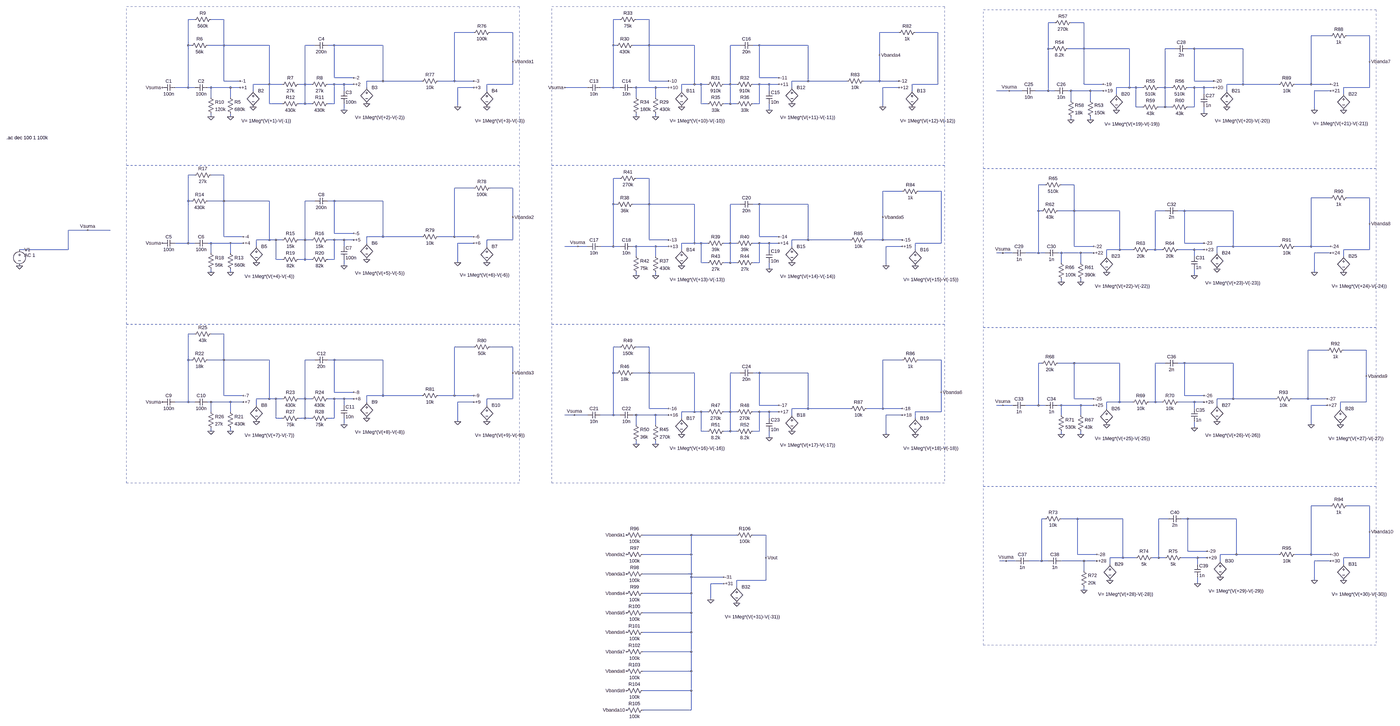
[diagram p0: schematic Ecualizador.asc, whole sheet]
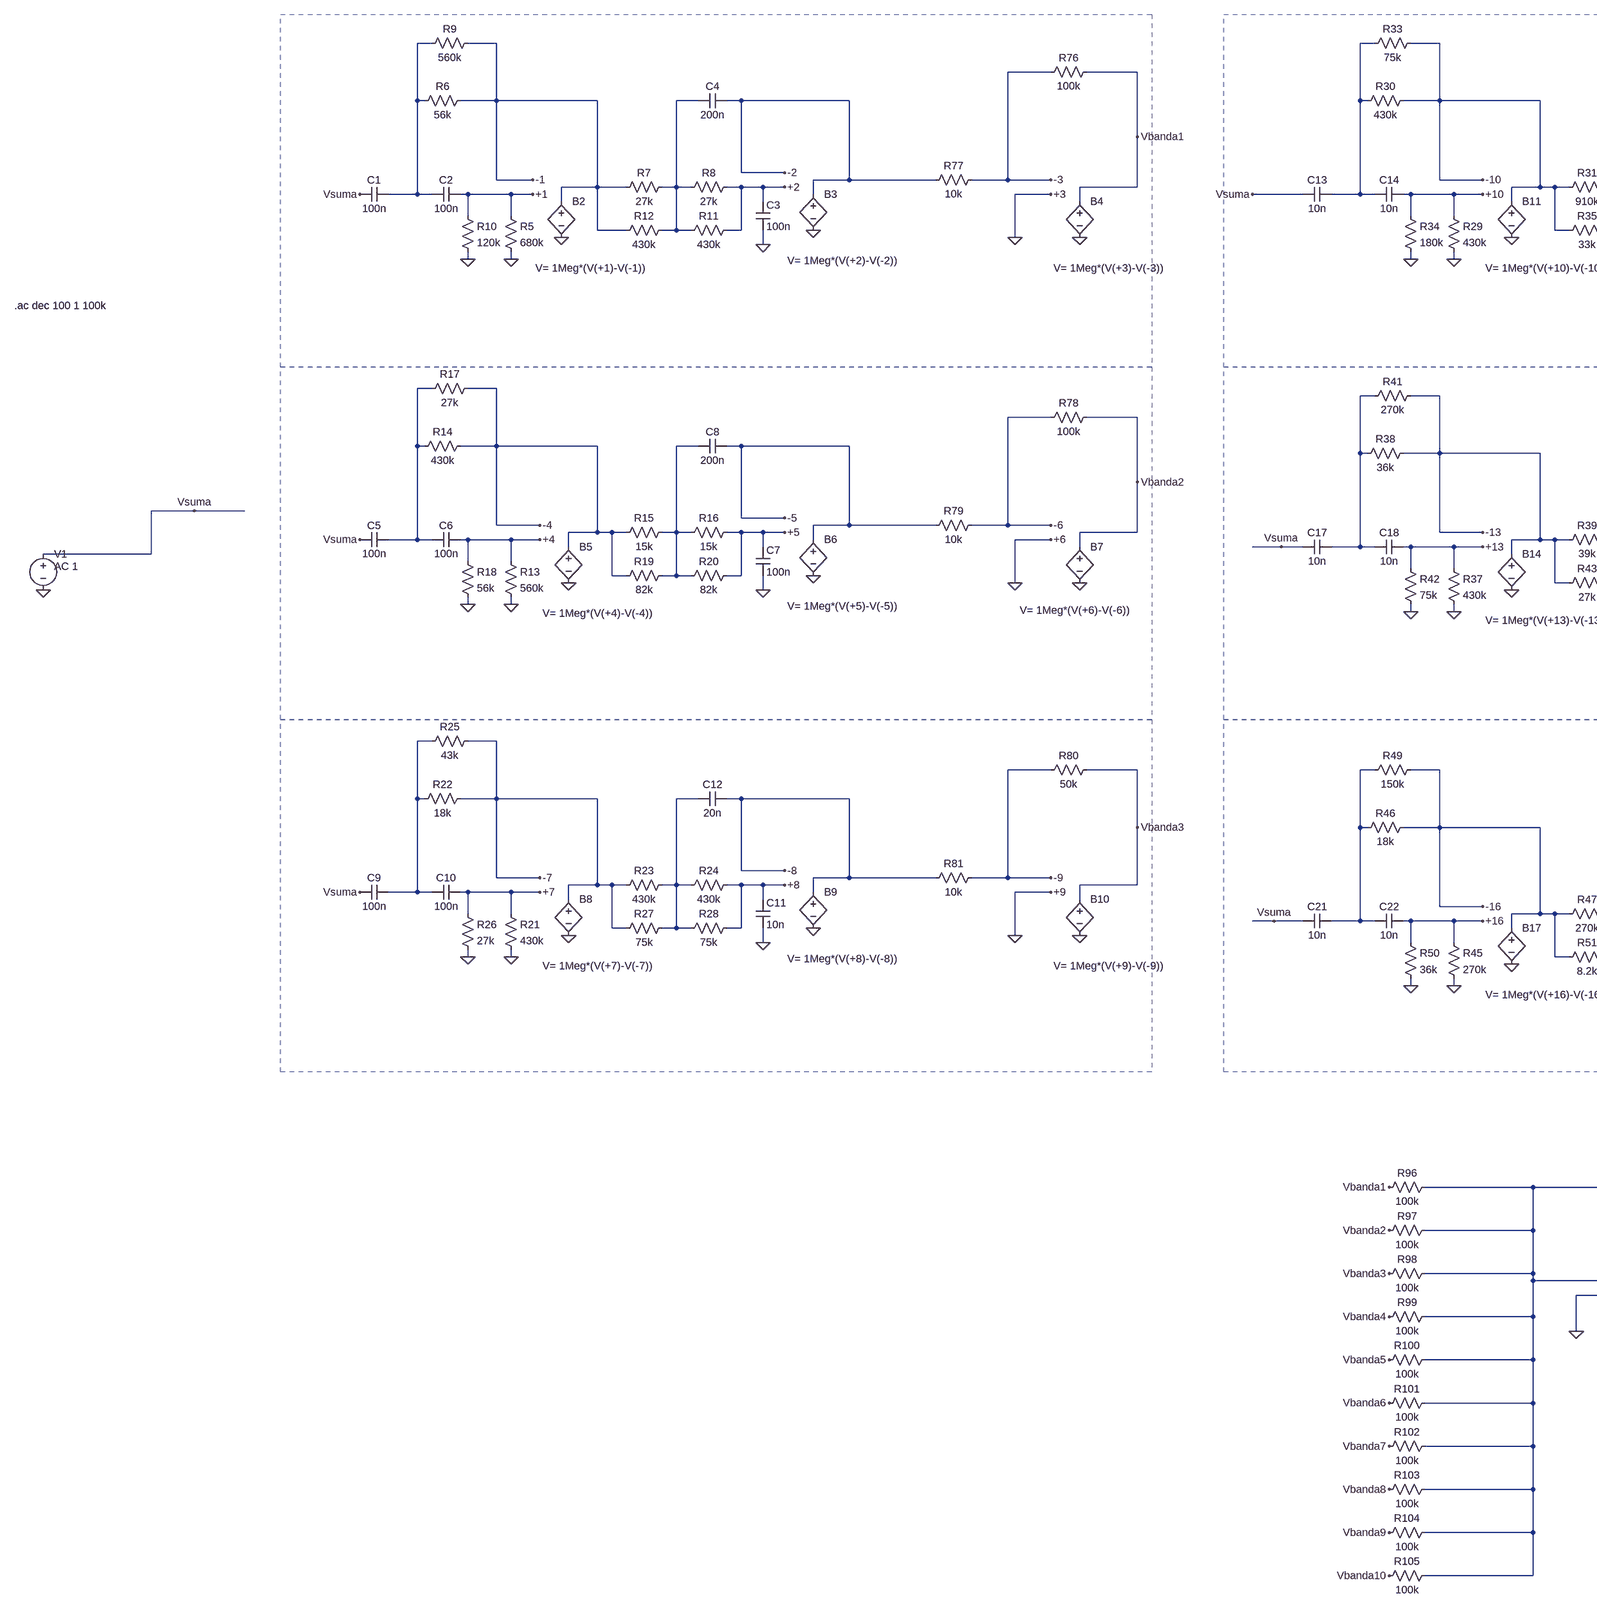
[diagram p1: schematic Ecualizador.asc, part, row 1 of 1, column 1 of 2]
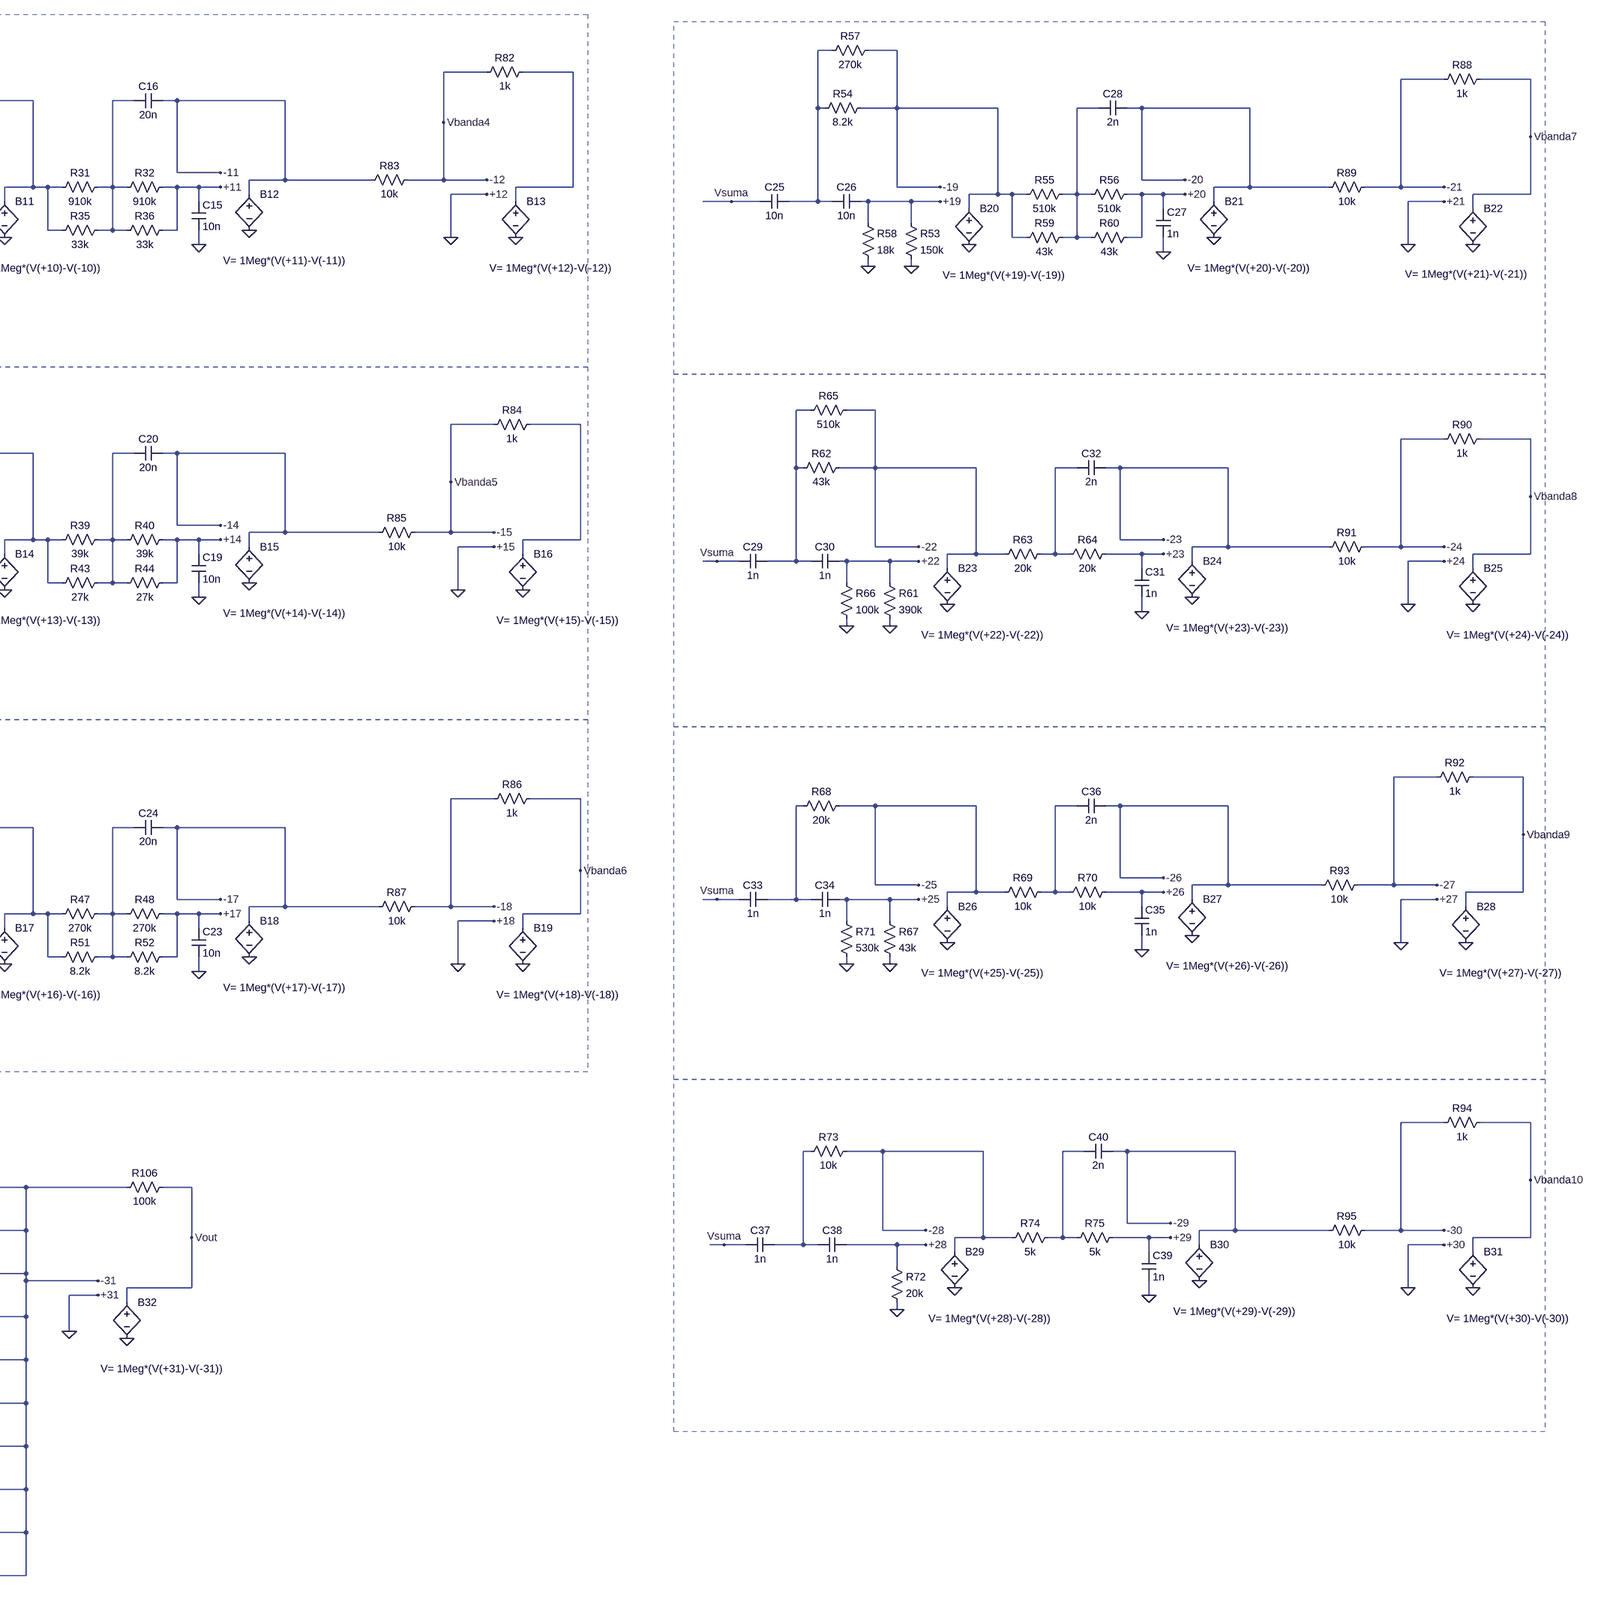
[diagram p2: schematic Ecualizador.asc, part, row 1 of 1, column 2 of 2]
Ecualizador.asc, the LTspice schematic file:
Version 4
SHEET 1 880 680
WIRE -20480 -74048 -20512 -74048
WIRE -20336 -74048 -20400 -74048
WIRE -18384 -74048 -18416 -74048
WIRE -18240 -74048 -18304 -74048
WIRE -16112 -74032 -16144 -74032
WIRE -15968 -74032 -16032 -74032
WIRE -19104 -73984 -19200 -73984
WIRE -18912 -73984 -19024 -73984
WIRE -17008 -73984 -17104 -73984
WIRE -16816 -73984 -16928 -73984
WIRE -14752 -73968 -14848 -73968
WIRE -14560 -73968 -14672 -73968
WIRE -20512 -73920 -20512 -74048
WIRE -20496 -73920 -20512 -73920
WIRE -20336 -73920 -20336 -74048
WIRE -20336 -73920 -20416 -73920
WIRE -20112 -73920 -20336 -73920
WIRE -19888 -73920 -19936 -73920
WIRE -19792 -73920 -19824 -73920
WIRE -19552 -73920 -19792 -73920
WIRE -18416 -73920 -18416 -74048
WIRE -18400 -73920 -18416 -73920
WIRE -18240 -73920 -18240 -74048
WIRE -18240 -73920 -18320 -73920
WIRE -18016 -73920 -18240 -73920
WIRE -17792 -73920 -17840 -73920
WIRE -17696 -73920 -17728 -73920
WIRE -17456 -73920 -17696 -73920
WIRE -16144 -73904 -16144 -74032
WIRE -16128 -73904 -16144 -73904
WIRE -15968 -73904 -15968 -74032
WIRE -15968 -73904 -16048 -73904
WIRE -15744 -73904 -15968 -73904
WIRE -15520 -73904 -15568 -73904
WIRE -15424 -73904 -15456 -73904
WIRE -15184 -73904 -15424 -73904
WIRE -17104 -73872 -17104 -73984
WIRE -18912 -73840 -18912 -73984
WIRE -14560 -73840 -14560 -73968
WIRE -19792 -73760 -19792 -73920
WIRE -19696 -73760 -19792 -73760
WIRE -17696 -73760 -17696 -73920
WIRE -17600 -73760 -17696 -73760
WIRE -20336 -73744 -20336 -73920
WIRE -20256 -73744 -20336 -73744
WIRE -19552 -73744 -19552 -73920
WIRE -19552 -73744 -19632 -73744
WIRE -19360 -73744 -19552 -73744
WIRE -19200 -73744 -19200 -73984
WIRE -19200 -73744 -19280 -73744
WIRE -19104 -73744 -19200 -73744
WIRE -18240 -73744 -18240 -73920
WIRE -18144 -73744 -18240 -73744
WIRE -17456 -73744 -17456 -73920
WIRE -17456 -73744 -17536 -73744
WIRE -17264 -73744 -17456 -73744
WIRE -17104 -73744 -17104 -73872
WIRE -17104 -73744 -17184 -73744
WIRE -17008 -73744 -17104 -73744
WIRE -15424 -73744 -15424 -73904
WIRE -15328 -73744 -15424 -73744
WIRE -20112 -73728 -20112 -73920
WIRE -20112 -73728 -20192 -73728
WIRE -20048 -73728 -20112 -73728
WIRE -19936 -73728 -19936 -73920
WIRE -19936 -73728 -19968 -73728
WIRE -19904 -73728 -19936 -73728
WIRE -19792 -73728 -19824 -73728
WIRE -19744 -73728 -19792 -73728
WIRE -19696 -73728 -19744 -73728
WIRE -18912 -73728 -18912 -73840
WIRE -18912 -73728 -19040 -73728
WIRE -18016 -73728 -18016 -73920
WIRE -18016 -73728 -18080 -73728
WIRE -17984 -73728 -18016 -73728
WIRE -17952 -73728 -17984 -73728
WIRE -17840 -73728 -17840 -73920
WIRE -17840 -73728 -17872 -73728
WIRE -17808 -73728 -17840 -73728
WIRE -17696 -73728 -17728 -73728
WIRE -17648 -73728 -17696 -73728
WIRE -17600 -73728 -17648 -73728
WIRE -16816 -73728 -16816 -73984
WIRE -16816 -73728 -16944 -73728
WIRE -15968 -73728 -15968 -73904
WIRE -15872 -73728 -15968 -73728
WIRE -15184 -73728 -15184 -73904
WIRE -15184 -73728 -15264 -73728
WIRE -15008 -73728 -15184 -73728
WIRE -14848 -73728 -14848 -73968
WIRE -14848 -73728 -14928 -73728
WIRE -14752 -73728 -14848 -73728
WIRE -20512 -73712 -20512 -73920
WIRE -20512 -73712 -20576 -73712
WIRE -20480 -73712 -20512 -73712
WIRE -20400 -73712 -20416 -73712
WIRE -20304 -73712 -20400 -73712
WIRE -20256 -73712 -20304 -73712
WIRE -19632 -73712 -19632 -73744
WIRE -19104 -73712 -19184 -73712
WIRE -18544 -73712 -18656 -73712
WIRE -18416 -73712 -18416 -73920
WIRE -18416 -73712 -18480 -73712
WIRE -18384 -73712 -18416 -73712
WIRE -18304 -73712 -18320 -73712
WIRE -18208 -73712 -18304 -73712
WIRE -18144 -73712 -18208 -73712
WIRE -17536 -73712 -17536 -73744
WIRE -17008 -73712 -17088 -73712
WIRE -15744 -73712 -15744 -73904
WIRE -15744 -73712 -15808 -73712
WIRE -15712 -73712 -15744 -73712
WIRE -15680 -73712 -15712 -73712
WIRE -15568 -73712 -15568 -73904
WIRE -15568 -73712 -15600 -73712
WIRE -15536 -73712 -15568 -73712
WIRE -15424 -73712 -15456 -73712
WIRE -15376 -73712 -15424 -73712
WIRE -15328 -73712 -15376 -73712
WIRE -14560 -73712 -14560 -73840
WIRE -14560 -73712 -14688 -73712
WIRE -20192 -73696 -20192 -73728
WIRE -19744 -73696 -19744 -73728
WIRE -19040 -73696 -19040 -73728
WIRE -18080 -73696 -18080 -73728
WIRE -17648 -73696 -17648 -73728
WIRE -16944 -73696 -16944 -73728
WIRE -16336 -73696 -16400 -73696
WIRE -16272 -73696 -16336 -73696
WIRE -16144 -73696 -16144 -73904
WIRE -16144 -73696 -16208 -73696
WIRE -16112 -73696 -16144 -73696
WIRE -16032 -73696 -16048 -73696
WIRE -15936 -73696 -16032 -73696
WIRE -15872 -73696 -15936 -73696
WIRE -15264 -73696 -15264 -73728
WIRE -14752 -73696 -14832 -73696
WIRE -15808 -73680 -15808 -73712
WIRE -15376 -73680 -15376 -73712
WIRE -14688 -73680 -14688 -73712
WIRE -20400 -73664 -20400 -73712
WIRE -20304 -73664 -20304 -73712
WIRE -18304 -73664 -18304 -73712
WIRE -18208 -73664 -18208 -73712
WIRE -16032 -73648 -16032 -73696
WIRE -15936 -73648 -15936 -73696
WIRE -20112 -73632 -20112 -73728
WIRE -20048 -73632 -20112 -73632
WIRE -19936 -73632 -19936 -73728
WIRE -19936 -73632 -19968 -73632
WIRE -19904 -73632 -19936 -73632
WIRE -19792 -73632 -19792 -73728
WIRE -19792 -73632 -19824 -73632
WIRE -17984 -73632 -17984 -73728
WIRE -17952 -73632 -17984 -73632
WIRE -17840 -73632 -17840 -73728
WIRE -17840 -73632 -17872 -73632
WIRE -17808 -73632 -17840 -73632
WIRE -17696 -73632 -17696 -73728
WIRE -17696 -73632 -17728 -73632
WIRE -19184 -73616 -19184 -73712
WIRE -17088 -73616 -17088 -73712
WIRE -15712 -73616 -15712 -73712
WIRE -15680 -73616 -15712 -73616
WIRE -15568 -73616 -15568 -73712
WIRE -15568 -73616 -15600 -73616
WIRE -15536 -73616 -15568 -73616
WIRE -15424 -73616 -15424 -73712
WIRE -15424 -73616 -15456 -73616
WIRE -19744 -73600 -19744 -73632
WIRE -17648 -73600 -17648 -73632
WIRE -14832 -73600 -14832 -73696
WIRE -15376 -73584 -15376 -73616
WIRE -20400 -73568 -20400 -73584
WIRE -20304 -73568 -20304 -73584
WIRE -18304 -73568 -18304 -73584
WIRE -18208 -73568 -18208 -73584
WIRE -16032 -73552 -16032 -73568
WIRE -15936 -73552 -15936 -73568
WIRE -20480 -73280 -20512 -73280
WIRE -20336 -73280 -20400 -73280
WIRE -18384 -73264 -18416 -73264
WIRE -18240 -73264 -18304 -73264
WIRE -16160 -73232 -16192 -73232
WIRE -16016 -73232 -16080 -73232
WIRE -19104 -73216 -19200 -73216
WIRE -18912 -73216 -19024 -73216
WIRE -16992 -73200 -17088 -73200
WIRE -16800 -73200 -16912 -73200
WIRE -14752 -73168 -14848 -73168
WIRE -14560 -73168 -14672 -73168
WIRE -20512 -73152 -20512 -73280
WIRE -20496 -73152 -20512 -73152
WIRE -20336 -73152 -20336 -73280
WIRE -20336 -73152 -20416 -73152
WIRE -20112 -73152 -20336 -73152
WIRE -19888 -73152 -19936 -73152
WIRE -19792 -73152 -19824 -73152
WIRE -19552 -73152 -19792 -73152
WIRE -18416 -73136 -18416 -73264
WIRE -18400 -73136 -18416 -73136
WIRE -18240 -73136 -18240 -73264
WIRE -18240 -73136 -18320 -73136
WIRE -18016 -73136 -18240 -73136
WIRE -17792 -73136 -17840 -73136
WIRE -17696 -73136 -17728 -73136
WIRE -17456 -73136 -17696 -73136
WIRE -16192 -73104 -16192 -73232
WIRE -16176 -73104 -16192 -73104
WIRE -16016 -73104 -16016 -73232
WIRE -16016 -73104 -16096 -73104
WIRE -15792 -73104 -16016 -73104
WIRE -15568 -73104 -15616 -73104
WIRE -15472 -73104 -15504 -73104
WIRE -15232 -73104 -15472 -73104
WIRE -18912 -73072 -18912 -73216
WIRE -17088 -73072 -17088 -73200
WIRE -14560 -73040 -14560 -73168
WIRE -21008 -73008 -21104 -73008
WIRE -20896 -73008 -21008 -73008
WIRE -19792 -72992 -19792 -73152
WIRE -19696 -72992 -19792 -72992
WIRE -20336 -72976 -20336 -73152
WIRE -20240 -72976 -20336 -72976
WIRE -19552 -72976 -19552 -73152
WIRE -19552 -72976 -19632 -72976
WIRE -19360 -72976 -19552 -72976
WIRE -19200 -72976 -19200 -73216
WIRE -19200 -72976 -19280 -72976
WIRE -19104 -72976 -19200 -72976
WIRE -17696 -72976 -17696 -73136
WIRE -17600 -72976 -17696 -72976
WIRE -20112 -72960 -20112 -73152
WIRE -20112 -72960 -20176 -72960
WIRE -20080 -72960 -20112 -72960
WIRE -20048 -72960 -20080 -72960
WIRE -19936 -72960 -19936 -73152
WIRE -19936 -72960 -19968 -72960
WIRE -19904 -72960 -19936 -72960
WIRE -19792 -72960 -19824 -72960
WIRE -19744 -72960 -19792 -72960
WIRE -19696 -72960 -19744 -72960
WIRE -18912 -72960 -18912 -73072
WIRE -18912 -72960 -19040 -72960
WIRE -18240 -72960 -18240 -73136
WIRE -18144 -72960 -18240 -72960
WIRE -17456 -72960 -17456 -73136
WIRE -17456 -72960 -17536 -72960
WIRE -17248 -72960 -17456 -72960
WIRE -17088 -72960 -17088 -73072
WIRE -17088 -72960 -17168 -72960
WIRE -16992 -72960 -17088 -72960
WIRE -20512 -72944 -20512 -73152
WIRE -20512 -72944 -20576 -72944
WIRE -20480 -72944 -20512 -72944
WIRE -20400 -72944 -20416 -72944
WIRE -20304 -72944 -20400 -72944
WIRE -20240 -72944 -20304 -72944
WIRE -19632 -72944 -19632 -72976
WIRE -19104 -72944 -19184 -72944
WIRE -18016 -72944 -18016 -73136
WIRE -18016 -72944 -18080 -72944
WIRE -17984 -72944 -18016 -72944
WIRE -17952 -72944 -17984 -72944
WIRE -17840 -72944 -17840 -73136
WIRE -17840 -72944 -17872 -72944
WIRE -17808 -72944 -17840 -72944
WIRE -17696 -72944 -17728 -72944
WIRE -17648 -72944 -17696 -72944
WIRE -17600 -72944 -17648 -72944
WIRE -16800 -72944 -16800 -73200
WIRE -16800 -72944 -16928 -72944
WIRE -15472 -72944 -15472 -73104
WIRE -15376 -72944 -15472 -72944
WIRE -20176 -72928 -20176 -72960
WIRE -19744 -72928 -19744 -72960
WIRE -19040 -72928 -19040 -72960
WIRE -18592 -72928 -18656 -72928
WIRE -18544 -72928 -18592 -72928
WIRE -18416 -72928 -18416 -73136
WIRE -18416 -72928 -18480 -72928
WIRE -18384 -72928 -18416 -72928
WIRE -18304 -72928 -18320 -72928
WIRE -18208 -72928 -18304 -72928
WIRE -18144 -72928 -18208 -72928
WIRE -17536 -72928 -17536 -72960
WIRE -16992 -72928 -17072 -72928
WIRE -16016 -72928 -16016 -73104
WIRE -15920 -72928 -16016 -72928
WIRE -15232 -72928 -15232 -73104
WIRE -15232 -72928 -15312 -72928
WIRE -15008 -72928 -15232 -72928
WIRE -14848 -72928 -14848 -73168
WIRE -14848 -72928 -14928 -72928
WIRE -14752 -72928 -14848 -72928
WIRE -21104 -72912 -21104 -73008
WIRE -21104 -72912 -21344 -72912
WIRE -18080 -72912 -18080 -72944
WIRE -17648 -72912 -17648 -72944
WIRE -16928 -72912 -16928 -72944
WIRE -15792 -72912 -15792 -73104
WIRE -15792 -72912 -15856 -72912
WIRE -15728 -72912 -15792 -72912
WIRE -15616 -72912 -15616 -73104
WIRE -15616 -72912 -15648 -72912
WIRE -15584 -72912 -15616 -72912
WIRE -15424 -72912 -15504 -72912
WIRE -15376 -72912 -15424 -72912
WIRE -14560 -72912 -14560 -73040
WIRE -14560 -72912 -14688 -72912
WIRE -20400 -72896 -20400 -72944
WIRE -20304 -72896 -20304 -72944
WIRE -16368 -72896 -16400 -72896
WIRE -16320 -72896 -16368 -72896
WIRE -16192 -72896 -16192 -73104
WIRE -16192 -72896 -16256 -72896
WIRE -16160 -72896 -16192 -72896
WIRE -16080 -72896 -16096 -72896
WIRE -15984 -72896 -16080 -72896
WIRE -15920 -72896 -15984 -72896
WIRE -15312 -72896 -15312 -72928
WIRE -14752 -72896 -14832 -72896
WIRE -18304 -72880 -18304 -72928
WIRE -18208 -72880 -18208 -72928
WIRE -15856 -72880 -15856 -72912
WIRE -15424 -72880 -15424 -72912
WIRE -14688 -72880 -14688 -72912
WIRE -20080 -72864 -20080 -72960
WIRE -20048 -72864 -20080 -72864
WIRE -19936 -72864 -19936 -72960
WIRE -19936 -72864 -19968 -72864
WIRE -19904 -72864 -19936 -72864
WIRE -19792 -72864 -19792 -72960
WIRE -19792 -72864 -19824 -72864
WIRE -19184 -72848 -19184 -72944
WIRE -17984 -72848 -17984 -72944
WIRE -17952 -72848 -17984 -72848
WIRE -17840 -72848 -17840 -72944
WIRE -17840 -72848 -17872 -72848
WIRE -17808 -72848 -17840 -72848
WIRE -17696 -72848 -17696 -72944
WIRE -17696 -72848 -17728 -72848
WIRE -16080 -72848 -16080 -72896
WIRE -15984 -72848 -15984 -72896
WIRE -19744 -72832 -19744 -72864
WIRE -17072 -72832 -17072 -72928
WIRE -17648 -72816 -17648 -72848
WIRE -20400 -72800 -20400 -72816
WIRE -20304 -72800 -20304 -72816
WIRE -14832 -72800 -14832 -72896
WIRE -18304 -72784 -18304 -72800
WIRE -18208 -72784 -18208 -72800
WIRE -15424 -72784 -15424 -72816
WIRE -16080 -72752 -16080 -72768
WIRE -15984 -72752 -15984 -72768
WIRE -20480 -72496 -20512 -72496
WIRE -20336 -72496 -20400 -72496
WIRE -19104 -72432 -19200 -72432
WIRE -18912 -72432 -19024 -72432
WIRE -18384 -72432 -18416 -72432
WIRE -18240 -72432 -18304 -72432
WIRE -14768 -72416 -14864 -72416
WIRE -14576 -72416 -14688 -72416
WIRE -20512 -72368 -20512 -72496
WIRE -20496 -72368 -20512 -72368
WIRE -20336 -72368 -20336 -72496
WIRE -20336 -72368 -20416 -72368
WIRE -20112 -72368 -20336 -72368
WIRE -19888 -72368 -19936 -72368
WIRE -19792 -72368 -19824 -72368
WIRE -19552 -72368 -19792 -72368
WIRE -16992 -72368 -17088 -72368
WIRE -16800 -72368 -16912 -72368
WIRE -16176 -72352 -16192 -72352
WIRE -16016 -72352 -16096 -72352
WIRE -15792 -72352 -16016 -72352
WIRE -15568 -72352 -15616 -72352
WIRE -15472 -72352 -15504 -72352
WIRE -15232 -72352 -15472 -72352
WIRE -18912 -72304 -18912 -72432
WIRE -18416 -72304 -18416 -72432
WIRE -18400 -72304 -18416 -72304
WIRE -18240 -72304 -18240 -72432
WIRE -18240 -72304 -18320 -72304
WIRE -18016 -72304 -18240 -72304
WIRE -17792 -72304 -17840 -72304
WIRE -17696 -72304 -17728 -72304
WIRE -17456 -72304 -17696 -72304
WIRE -14576 -72288 -14576 -72416
WIRE -19792 -72208 -19792 -72368
WIRE -19696 -72208 -19792 -72208
WIRE -16800 -72208 -16800 -72368
WIRE -20336 -72192 -20336 -72368
WIRE -20240 -72192 -20336 -72192
WIRE -19552 -72192 -19552 -72368
WIRE -19552 -72192 -19632 -72192
WIRE -19360 -72192 -19552 -72192
WIRE -19200 -72192 -19200 -72432
WIRE -19200 -72192 -19280 -72192
WIRE -19104 -72192 -19200 -72192
WIRE -15472 -72192 -15472 -72352
WIRE -15376 -72192 -15472 -72192
WIRE -20112 -72176 -20112 -72368
WIRE -20112 -72176 -20176 -72176
WIRE -20080 -72176 -20112 -72176
WIRE -20048 -72176 -20080 -72176
WIRE -19936 -72176 -19936 -72368
WIRE -19936 -72176 -19968 -72176
WIRE -19904 -72176 -19936 -72176
WIRE -19792 -72176 -19824 -72176
WIRE -19744 -72176 -19792 -72176
WIRE -19696 -72176 -19744 -72176
WIRE -18912 -72176 -18912 -72304
WIRE -18912 -72176 -19040 -72176
WIRE -16016 -72176 -16016 -72352
WIRE -15920 -72176 -16016 -72176
WIRE -15232 -72176 -15232 -72352
WIRE -15232 -72176 -15312 -72176
WIRE -15024 -72176 -15232 -72176
WIRE -14864 -72176 -14864 -72416
WIRE -14864 -72176 -14944 -72176
WIRE -14768 -72176 -14864 -72176
WIRE -20512 -72160 -20512 -72368
WIRE -20512 -72160 -20576 -72160
WIRE -20480 -72160 -20512 -72160
WIRE -20400 -72160 -20416 -72160
WIRE -20304 -72160 -20400 -72160
WIRE -20240 -72160 -20304 -72160
WIRE -19632 -72160 -19632 -72192
WIRE -19104 -72160 -19184 -72160
WIRE -15792 -72160 -15792 -72352
WIRE -15792 -72160 -15856 -72160
WIRE -15728 -72160 -15792 -72160
WIRE -15616 -72160 -15616 -72352
WIRE -15616 -72160 -15648 -72160
WIRE -15584 -72160 -15616 -72160
WIRE -15424 -72160 -15504 -72160
WIRE -15376 -72160 -15424 -72160
WIRE -14576 -72160 -14576 -72288
WIRE -14576 -72160 -14704 -72160
WIRE -20176 -72144 -20176 -72176
WIRE -19744 -72144 -19744 -72176
WIRE -19040 -72144 -19040 -72176
WIRE -17696 -72144 -17696 -72304
WIRE -17600 -72144 -17696 -72144
WIRE -16368 -72144 -16400 -72144
WIRE -16320 -72144 -16368 -72144
WIRE -16192 -72144 -16192 -72352
WIRE -16192 -72144 -16256 -72144
WIRE -16160 -72144 -16192 -72144
WIRE -16080 -72144 -16096 -72144
WIRE -15984 -72144 -16080 -72144
WIRE -15920 -72144 -15984 -72144
WIRE -15312 -72144 -15312 -72176
WIRE -14768 -72144 -14848 -72144
WIRE -18240 -72128 -18240 -72304
WIRE -18144 -72128 -18240 -72128
WIRE -17456 -72128 -17456 -72304
WIRE -17456 -72128 -17536 -72128
WIRE -17248 -72128 -17456 -72128
WIRE -17088 -72128 -17088 -72368
WIRE -17088 -72128 -17168 -72128
WIRE -16992 -72128 -17088 -72128
WIRE -15856 -72128 -15856 -72160
WIRE -15424 -72128 -15424 -72160
WIRE -14704 -72128 -14704 -72160
WIRE -20400 -72112 -20400 -72160
WIRE -20304 -72112 -20304 -72160
WIRE -18016 -72112 -18016 -72304
WIRE -18016 -72112 -18080 -72112
WIRE -17984 -72112 -18016 -72112
WIRE -17952 -72112 -17984 -72112
WIRE -17840 -72112 -17840 -72304
WIRE -17840 -72112 -17872 -72112
WIRE -17808 -72112 -17840 -72112
WIRE -17696 -72112 -17728 -72112
WIRE -17648 -72112 -17696 -72112
WIRE -17600 -72112 -17648 -72112
WIRE -16800 -72112 -16800 -72208
WIRE -16800 -72112 -16928 -72112
WIRE -18608 -72096 -18656 -72096
WIRE -18544 -72096 -18608 -72096
WIRE -18416 -72096 -18416 -72304
WIRE -18416 -72096 -18480 -72096
WIRE -18384 -72096 -18416 -72096
WIRE -18304 -72096 -18320 -72096
WIRE -18208 -72096 -18304 -72096
WIRE -18144 -72096 -18208 -72096
WIRE -17536 -72096 -17536 -72128
WIRE -16992 -72096 -17072 -72096
WIRE -16080 -72096 -16080 -72144
WIRE -15984 -72096 -15984 -72144
WIRE -20080 -72080 -20080 -72176
WIRE -20048 -72080 -20080 -72080
WIRE -19936 -72080 -19936 -72176
WIRE -19936 -72080 -19968 -72080
WIRE -19904 -72080 -19936 -72080
WIRE -19792 -72080 -19792 -72176
WIRE -19792 -72080 -19824 -72080
WIRE -18080 -72080 -18080 -72112
WIRE -17648 -72080 -17648 -72112
WIRE -16928 -72080 -16928 -72112
WIRE -19184 -72064 -19184 -72160
WIRE -19744 -72048 -19744 -72080
WIRE -18304 -72048 -18304 -72096
WIRE -18208 -72048 -18208 -72096
WIRE -14848 -72048 -14848 -72144
WIRE -15424 -72032 -15424 -72064
WIRE -20400 -72016 -20400 -72032
WIRE -20304 -72016 -20304 -72032
WIRE -17984 -72016 -17984 -72112
WIRE -17952 -72016 -17984 -72016
WIRE -17840 -72016 -17840 -72112
WIRE -17840 -72016 -17872 -72016
WIRE -17808 -72016 -17840 -72016
WIRE -17696 -72016 -17696 -72112
WIRE -17696 -72016 -17728 -72016
WIRE -17072 -72000 -17072 -72096
WIRE -16080 -72000 -16080 -72016
WIRE -15984 -72000 -15984 -72016
WIRE -17648 -71984 -17648 -72016
WIRE -18304 -71952 -18304 -71968
WIRE -18208 -71952 -18208 -71968
WIRE -14752 -71648 -14848 -71648
WIRE -14560 -71648 -14672 -71648
WIRE -16160 -71584 -16176 -71584
WIRE -16000 -71584 -16080 -71584
WIRE -15776 -71584 -16000 -71584
WIRE -15552 -71584 -15600 -71584
WIRE -15456 -71584 -15488 -71584
WIRE -15216 -71584 -15456 -71584
WIRE -14560 -71520 -14560 -71648
WIRE -18032 -71504 -18272 -71504
WIRE -17808 -71504 -18032 -71504
WIRE -17664 -71504 -17728 -71504
WIRE -15456 -71424 -15456 -71584
WIRE -15360 -71424 -15456 -71424
WIRE -18032 -71408 -18032 -71504
WIRE -18032 -71408 -18272 -71408
WIRE -16000 -71408 -16000 -71584
WIRE -15904 -71408 -16000 -71408
WIRE -15216 -71408 -15216 -71584
WIRE -15216 -71408 -15296 -71408
WIRE -15008 -71408 -15216 -71408
WIRE -14848 -71408 -14848 -71648
WIRE -14848 -71408 -14928 -71408
WIRE -14752 -71408 -14848 -71408
WIRE -17664 -71392 -17664 -71504
WIRE -15776 -71392 -15776 -71584
WIRE -15776 -71392 -15840 -71392
WIRE -15712 -71392 -15776 -71392
WIRE -15600 -71392 -15600 -71584
WIRE -15600 -71392 -15632 -71392
WIRE -15568 -71392 -15600 -71392
WIRE -15408 -71392 -15488 -71392
WIRE -15360 -71392 -15408 -71392
WIRE -14560 -71392 -14560 -71520
WIRE -14560 -71392 -14688 -71392
WIRE -16352 -71376 -16384 -71376
WIRE -16304 -71376 -16352 -71376
WIRE -16176 -71376 -16176 -71584
WIRE -16176 -71376 -16240 -71376
WIRE -16144 -71376 -16176 -71376
WIRE -15968 -71376 -16080 -71376
WIRE -15904 -71376 -15968 -71376
WIRE -15296 -71376 -15296 -71408
WIRE -14752 -71376 -14832 -71376
WIRE -15840 -71360 -15840 -71392
WIRE -15408 -71360 -15408 -71392
WIRE -14688 -71360 -14688 -71392
WIRE -15968 -71328 -15968 -71376
WIRE -18032 -71312 -18032 -71408
WIRE -18032 -71312 -18272 -71312
WIRE -18032 -71296 -18032 -71312
WIRE -17872 -71296 -18032 -71296
WIRE -17664 -71280 -17664 -71392
WIRE -17664 -71280 -17808 -71280
WIRE -14832 -71280 -14832 -71376
WIRE -17872 -71264 -17936 -71264
WIRE -15408 -71264 -15408 -71296
WIRE -17808 -71248 -17808 -71280
WIRE -15968 -71232 -15968 -71248
WIRE -18032 -71216 -18032 -71296
WIRE -18032 -71216 -18272 -71216
WIRE -17936 -71184 -17936 -71264
WIRE -18032 -71120 -18032 -71216
WIRE -18032 -71120 -18272 -71120
WIRE -18032 -71024 -18032 -71120
WIRE -18032 -71024 -18272 -71024
WIRE -18032 -70928 -18032 -71024
WIRE -18032 -70928 -18272 -70928
WIRE -18032 -70832 -18032 -70928
WIRE -18032 -70832 -18272 -70832
WIRE -18032 -70736 -18032 -70832
WIRE -18032 -70736 -18272 -70736
WIRE -18032 -70640 -18032 -70736
WIRE -18032 -70640 -18272 -70640
FLAG -20304 -73568 0
FLAG -19744 -73600 0
FLAG -20400 -73568 0
FLAG -18912 -73840 Vbanda1
FLAG -20304 -72800 0
FLAG -19744 -72832 0
FLAG -20400 -72800 0
FLAG -18912 -73072 Vbanda2
FLAG -20304 -72016 0
FLAG -19744 -72048 0
FLAG -20400 -72016 0
FLAG -18912 -72304 Vbanda3
FLAG -18208 -73568 0
FLAG -17648 -73600 0
FLAG -18304 -73568 0
FLAG -17104 -73872 Vbanda4
FLAG -18208 -72784 0
FLAG -17648 -72816 0
FLAG -18304 -72784 0
FLAG -17088 -73072 Vbanda5
FLAG -18208 -71952 0
FLAG -17648 -71984 0
FLAG -18304 -71952 0
FLAG -16800 -72208 Vbanda6
FLAG -15936 -73552 0
FLAG -15376 -73584 0
FLAG -16032 -73552 0
FLAG -14560 -73840 Vbanda7
FLAG -15984 -72752 0
FLAG -15424 -72784 0
FLAG -16080 -72752 0
FLAG -14560 -73040 Vbanda8
FLAG -15984 -72000 0
FLAG -15424 -72032 0
FLAG -16080 -72000 0
FLAG -14576 -72288 Vbanda9
FLAG -15968 -71232 0
FLAG -15408 -71264 0
FLAG -14560 -71520 Vbanda10
FLAG -19184 -73616 0
FLAG -19184 -72848 0
FLAG -19184 -72064 0
FLAG -17088 -73616 0
FLAG -17072 -72832 0
FLAG -17072 -72000 0
FLAG -14832 -73600 0
FLAG -14832 -72800 0
FLAG -14848 -72048 0
FLAG -14832 -71280 0
FLAG -21008 -73008 Vsuma
FLAG -20256 -73712 +1
FLAG -20192 -73616 0
FLAG -20256 -73744 -1
FLAG -19696 -73728 +2
FLAG -19696 -73760 -2
FLAG -19632 -73632 0
FLAG -19104 -73744 -3
FLAG -19040 -73616 0
FLAG -19104 -73712 +3
FLAG -20240 -72944 +4
FLAG -20176 -72848 0
FLAG -20240 -72976 -4
FLAG -19696 -72960 +5
FLAG -19632 -72864 0
FLAG -19696 -72992 -5
FLAG -19104 -72944 +6
FLAG -19040 -72848 0
FLAG -19104 -72976 -6
FLAG -20240 -72160 +7
FLAG -20176 -72064 0
FLAG -20240 -72192 -7
FLAG -19696 -72176 +8
FLAG -19632 -72080 0
FLAG -19696 -72208 -8
FLAG -19104 -72160 +9
FLAG -19040 -72064 0
FLAG -19104 -72192 -9
FLAG -20640 -73712 Vsuma
FLAG -20640 -72944 Vsuma
FLAG -20640 -72160 Vsuma
FLAG -18656 -73712 Vsuma
FLAG -18144 -73744 -10
FLAG -18080 -73616 0
FLAG -18144 -73712 +10
FLAG -17600 -73760 -11
FLAG -17536 -73632 0
FLAG -17600 -73728 +11
FLAG -17008 -73744 -12
FLAG -16944 -73616 0
FLAG -17008 -73712 +12
FLAG -18592 -72928 Vsuma
FLAG -18144 -72960 -13
FLAG -18080 -72832 0
FLAG -18144 -72928 +13
FLAG -17600 -72976 -14
FLAG -17536 -72848 0
FLAG -17600 -72944 +14
FLAG -16992 -72960 -15
FLAG -16928 -72832 0
FLAG -16992 -72928 +15
FLAG -18608 -72096 Vsuma
FLAG -18144 -72128 -16
FLAG -18080 -72000 0
FLAG -18144 -72096 +16
FLAG -17600 -72144 -17
FLAG -17536 -72016 0
FLAG -17600 -72112 +17
FLAG -16992 -72128 -18
FLAG -16928 -72000 0
FLAG -16992 -72096 +18
FLAG -16336 -73696 Vsuma
FLAG -15872 -73728 -19
FLAG -15808 -73600 0
FLAG -15872 -73696 +19
FLAG -15328 -73744 -20
FLAG -15264 -73616 0
FLAG -15328 -73712 +20
FLAG -14752 -73728 -21
FLAG -14688 -73600 0
FLAG -14752 -73696 +21
FLAG -16368 -72896 Vsuma
FLAG -15920 -72928 -22
FLAG -15856 -72800 0
FLAG -15920 -72896 +22
FLAG -15376 -72944 -23
FLAG -15312 -72816 0
FLAG -15376 -72912 +23
FLAG -14752 -72928 -24
FLAG -14688 -72800 0
FLAG -14752 -72896 +24
FLAG -16368 -72144 Vsuma
FLAG -15920 -72176 -25
FLAG -15856 -72048 0
FLAG -15920 -72144 +25
FLAG -15376 -72192 -26
FLAG -15312 -72064 0
FLAG -15376 -72160 +26
FLAG -14768 -72176 -27
FLAG -14704 -72048 0
FLAG -14768 -72144 +27
FLAG -16352 -71376 Vsuma
FLAG -15904 -71408 -28
FLAG -15840 -71280 0
FLAG -15904 -71376 +28
FLAG -15360 -71424 -29
FLAG -15296 -71296 0
FLAG -15360 -71392 +29
FLAG -14752 -71408 -30
FLAG -14688 -71280 0
FLAG -14752 -71376 +30
FLAG -18352 -70640 Vbanda10
FLAG -18352 -70736 Vbanda9
FLAG -18352 -70832 Vbanda8
FLAG -18352 -70928 Vbanda7
FLAG -18352 -71024 Vbanda6
FLAG -18352 -71120 Vbanda5
FLAG -18352 -71216 Vbanda4
FLAG -18352 -71312 Vbanda3
FLAG -18352 -71408 Vbanda2
FLAG -18352 -71504 Vbanda1
FLAG -17872 -71296 -31
FLAG -17808 -71168 0
FLAG -17872 -71264 +31
FLAG -17664 -71392 Vout
FLAG -17936 -71184 0
FLAG -21344 -72832 0
SYMBOL cap -20576 -73728 R90
WINDOW 0 0 32 VBottom 2
WINDOW 3 32 32 VTop 2
SYMATTR InstName C1
SYMATTR Value 100n
SYMBOL cap -20416 -73728 R90
WINDOW 0 0 32 VBottom 2
WINDOW 3 32 32 VTop 2
SYMATTR InstName C2
SYMATTR Value 100n
SYMBOL res -20320 -73680 R0
SYMATTR InstName R5
SYMATTR Value 680k
SYMBOL res -20400 -73936 R90
WINDOW 0 0 56 VBottom 2
WINDOW 3 32 56 VTop 2
SYMATTR InstName R6
SYMATTR Value 56k
SYMBOL res -19952 -73744 R90
WINDOW 0 0 56 VBottom 2
WINDOW 3 32 56 VTop 2
SYMATTR InstName R7
SYMATTR Value 27k
SYMBOL res -19808 -73744 R90
WINDOW 0 0 56 VBottom 2
WINDOW 3 32 56 VTop 2
SYMATTR InstName R8
SYMATTR Value 27k
SYMBOL cap -19760 -73696 R0
SYMATTR InstName C3
SYMATTR Value 100n
SYMBOL cap -19824 -73936 R90
WINDOW 0 0 32 VBottom 2
WINDOW 3 32 32 VTop 2
SYMATTR InstName C4
SYMATTR Value 200n
SYMBOL res -20384 -74064 R90
WINDOW 0 0 56 VBottom 2
WINDOW 3 32 56 VTop 2
SYMATTR InstName R9
SYMATTR Value 560k
SYMBOL res -20416 -73680 R0
SYMATTR InstName R10
SYMATTR Value 120k
SYMBOL res -19808 -73648 R90
WINDOW 0 0 56 VBottom 2
WINDOW 3 32 56 VTop 2
SYMATTR InstName R11
SYMATTR Value 430k
SYMBOL res -19952 -73648 R90
WINDOW 0 0 56 VBottom 2
WINDOW 3 32 56 VTop 2
SYMATTR InstName R12
SYMATTR Value 430k
SYMBOL cap -20576 -72960 R90
WINDOW 0 0 32 VBottom 2
WINDOW 3 32 32 VTop 2
SYMATTR InstName C5
SYMATTR Value 100n
SYMBOL cap -20416 -72960 R90
WINDOW 0 0 32 VBottom 2
WINDOW 3 32 32 VTop 2
SYMATTR InstName C6
SYMATTR Value 100n
SYMBOL res -20320 -72912 R0
SYMATTR InstName R13
SYMATTR Value 560k
SYMBOL res -20400 -73168 R90
WINDOW 0 0 56 VBottom 2
WINDOW 3 32 56 VTop 2
SYMATTR InstName R14
SYMATTR Value 430k
SYMBOL res -19952 -72976 R90
WINDOW 0 0 56 VBottom 2
WINDOW 3 32 56 VTop 2
SYMATTR InstName R15
SYMATTR Value 15k
SYMBOL res -19808 -72976 R90
WINDOW 0 0 56 VBottom 2
WINDOW 3 32 56 VTop 2
SYMATTR InstName R16
SYMATTR Value 15k
SYMBOL cap -19760 -72928 R0
SYMATTR InstName C7
SYMATTR Value 100n
SYMBOL cap -19824 -73168 R90
WINDOW 0 0 32 VBottom 2
WINDOW 3 32 32 VTop 2
SYMATTR InstName C8
SYMATTR Value 200n
SYMBOL res -20384 -73296 R90
WINDOW 0 0 56 VBottom 2
WINDOW 3 32 56 VTop 2
SYMATTR InstName R17
SYMATTR Value 27k
SYMBOL res -20416 -72912 R0
SYMATTR InstName R18
SYMATTR Value 56k
SYMBOL res -19952 -72880 R90
WINDOW 0 0 56 VBottom 2
WINDOW 3 32 56 VTop 2
SYMATTR InstName R19
SYMATTR Value 82k
SYMBOL res -19808 -72880 R90
WINDOW 0 0 56 VBottom 2
WINDOW 3 32 56 VTop 2
SYMATTR InstName R20
SYMATTR Value 82k
SYMBOL cap -20576 -72176 R90
WINDOW 0 0 32 VBottom 2
WINDOW 3 32 32 VTop 2
SYMATTR InstName C9
SYMATTR Value 100n
SYMBOL cap -20416 -72176 R90
WINDOW 0 0 32 VBottom 2
WINDOW 3 32 32 VTop 2
SYMATTR InstName C10
SYMATTR Value 100n
SYMBOL res -20320 -72128 R0
SYMATTR InstName R21
SYMATTR Value 430k
SYMBOL res -20400 -72384 R90
WINDOW 0 0 56 VBottom 2
WINDOW 3 32 56 VTop 2
SYMATTR InstName R22
SYMATTR Value 18k
SYMBOL res -19952 -72192 R90
WINDOW 0 0 56 VBottom 2
WINDOW 3 32 56 VTop 2
SYMATTR InstName R23
SYMATTR Value 430k
SYMBOL res -19808 -72192 R90
WINDOW 0 0 56 VBottom 2
WINDOW 3 32 56 VTop 2
SYMATTR InstName R24
SYMATTR Value 430k
SYMBOL cap -19760 -72144 R0
SYMATTR InstName C11
SYMATTR Value 10n
SYMBOL cap -19824 -72384 R90
WINDOW 0 0 32 VBottom 2
WINDOW 3 32 32 VTop 2
SYMATTR InstName C12
SYMATTR Value 20n
SYMBOL res -20384 -72512 R90
WINDOW 0 0 56 VBottom 2
WINDOW 3 32 56 VTop 2
SYMATTR InstName R25
SYMATTR Value 43k
SYMBOL res -20416 -72128 R0
SYMATTR InstName R26
SYMATTR Value 27k
SYMBOL res -19952 -72096 R90
WINDOW 0 0 56 VBottom 2
WINDOW 3 32 56 VTop 2
SYMATTR InstName R27
SYMATTR Value 75k
SYMBOL res -19808 -72096 R90
WINDOW 0 0 56 VBottom 2
WINDOW 3 32 56 VTop 2
SYMATTR InstName R28
SYMATTR Value 75k
SYMBOL cap -18480 -73728 R90
WINDOW 0 0 32 VBottom 2
WINDOW 3 32 32 VTop 2
SYMATTR InstName C13
SYMATTR Value 10n
SYMBOL cap -18320 -73728 R90
WINDOW 0 0 32 VBottom 2
WINDOW 3 32 32 VTop 2
SYMATTR InstName C14
SYMATTR Value 10n
SYMBOL res -18224 -73680 R0
SYMATTR InstName R29
SYMATTR Value 430k
SYMBOL res -18304 -73936 R90
WINDOW 0 0 56 VBottom 2
WINDOW 3 32 56 VTop 2
SYMATTR InstName R30
SYMATTR Value 430k
SYMBOL res -17856 -73744 R90
WINDOW 0 0 56 VBottom 2
WINDOW 3 32 56 VTop 2
SYMATTR InstName R31
SYMATTR Value 910k
SYMBOL res -17712 -73744 R90
WINDOW 0 0 56 VBottom 2
WINDOW 3 32 56 VTop 2
SYMATTR InstName R32
SYMATTR Value 910k
SYMBOL cap -17664 -73696 R0
SYMATTR InstName C15
SYMATTR Value 10n
SYMBOL cap -17728 -73936 R90
WINDOW 0 0 32 VBottom 2
WINDOW 3 32 32 VTop 2
SYMATTR InstName C16
SYMATTR Value 20n
SYMBOL res -18288 -74064 R90
WINDOW 0 0 56 VBottom 2
WINDOW 3 32 56 VTop 2
SYMATTR InstName R33
SYMATTR Value 75k
SYMBOL res -18320 -73680 R0
SYMATTR InstName R34
SYMATTR Value 180k
SYMBOL res -17856 -73648 R90
WINDOW 0 0 56 VBottom 2
WINDOW 3 32 56 VTop 2
SYMATTR InstName R35
SYMATTR Value 33k
SYMBOL res -17712 -73648 R90
WINDOW 0 0 56 VBottom 2
WINDOW 3 32 56 VTop 2
SYMATTR InstName R36
SYMATTR Value 33k
SYMBOL cap -18480 -72944 R90
WINDOW 0 0 32 VBottom 2
WINDOW 3 32 32 VTop 2
SYMATTR InstName C17
SYMATTR Value 10n
SYMBOL cap -18320 -72944 R90
WINDOW 0 0 32 VBottom 2
WINDOW 3 32 32 VTop 2
SYMATTR InstName C18
SYMATTR Value 10n
SYMBOL res -18224 -72896 R0
SYMATTR InstName R37
SYMATTR Value 430k
SYMBOL res -18304 -73152 R90
WINDOW 0 0 56 VBottom 2
WINDOW 3 32 56 VTop 2
SYMATTR InstName R38
SYMATTR Value 36k
SYMBOL res -17856 -72960 R90
WINDOW 0 0 56 VBottom 2
WINDOW 3 32 56 VTop 2
SYMATTR InstName R39
SYMATTR Value 39k
SYMBOL res -17712 -72960 R90
WINDOW 0 0 56 VBottom 2
WINDOW 3 32 56 VTop 2
SYMATTR InstName R40
SYMATTR Value 39k
SYMBOL cap -17664 -72912 R0
SYMATTR InstName C19
SYMATTR Value 10n
SYMBOL cap -17728 -73152 R90
WINDOW 0 0 32 VBottom 2
WINDOW 3 32 32 VTop 2
SYMATTR InstName C20
SYMATTR Value 20n
SYMBOL res -18288 -73280 R90
WINDOW 0 0 56 VBottom 2
WINDOW 3 32 56 VTop 2
SYMATTR InstName R41
SYMATTR Value 270k
SYMBOL res -18320 -72896 R0
SYMATTR InstName R42
SYMATTR Value 75k
SYMBOL res -17856 -72864 R90
WINDOW 0 0 56 VBottom 2
WINDOW 3 32 56 VTop 2
SYMATTR InstName R43
SYMATTR Value 27k
SYMBOL res -17712 -72864 R90
WINDOW 0 0 56 VBottom 2
WINDOW 3 32 56 VTop 2
SYMATTR InstName R44
SYMATTR Value 27k
SYMBOL cap -18480 -72112 R90
WINDOW 0 0 32 VBottom 2
WINDOW 3 32 32 VTop 2
SYMATTR InstName C21
SYMATTR Value 10n
SYMBOL cap -18320 -72112 R90
WINDOW 0 0 32 VBottom 2
WINDOW 3 32 32 VTop 2
SYMATTR InstName C22
SYMATTR Value 10n
SYMBOL res -18224 -72064 R0
SYMATTR InstName R45
SYMATTR Value 270k
SYMBOL res -18304 -72320 R90
WINDOW 0 0 56 VBottom 2
WINDOW 3 32 56 VTop 2
SYMATTR InstName R46
SYMATTR Value 18k
SYMBOL res -17856 -72128 R90
WINDOW 0 0 56 VBottom 2
WINDOW 3 32 56 VTop 2
SYMATTR InstName R47
SYMATTR Value 270k
SYMBOL res -17712 -72128 R90
WINDOW 0 0 56 VBottom 2
WINDOW 3 32 56 VTop 2
SYMATTR InstName R48
SYMATTR Value 270k
SYMBOL cap -17664 -72080 R0
SYMATTR InstName C23
SYMATTR Value 10n
SYMBOL cap -17728 -72320 R90
WINDOW 0 0 32 VBottom 2
WINDOW 3 32 32 VTop 2
SYMATTR InstName C24
SYMATTR Value 20n
SYMBOL res -18288 -72448 R90
WINDOW 0 0 56 VBottom 2
WINDOW 3 32 56 VTop 2
SYMATTR InstName R49
SYMATTR Value 150k
SYMBOL res -18320 -72064 R0
SYMATTR InstName R50
SYMATTR Value 36k
SYMBOL res -17856 -72032 R90
WINDOW 0 0 56 VBottom 2
WINDOW 3 32 56 VTop 2
SYMATTR InstName R51
SYMATTR Value 8.2k
SYMBOL res -17712 -72032 R90
WINDOW 0 0 56 VBottom 2
WINDOW 3 32 56 VTop 2
SYMATTR InstName R52
SYMATTR Value 8.2k
SYMBOL cap -16208 -73712 R90
WINDOW 0 0 32 VBottom 2
WINDOW 3 32 32 VTop 2
SYMATTR InstName C25
SYMATTR Value 10n
SYMBOL cap -16048 -73712 R90
WINDOW 0 0 32 VBottom 2
WINDOW 3 32 32 VTop 2
SYMATTR InstName C26
SYMATTR Value 10n
SYMBOL res -15952 -73664 R0
SYMATTR InstName R53
SYMATTR Value 150k
SYMBOL res -16032 -73920 R90
WINDOW 0 0 56 VBottom 2
WINDOW 3 32 56 VTop 2
SYMATTR InstName R54
SYMATTR Value 8.2k
SYMBOL res -15584 -73728 R90
WINDOW 0 0 56 VBottom 2
WINDOW 3 32 56 VTop 2
SYMATTR InstName R55
SYMATTR Value 510k
SYMBOL res -15440 -73728 R90
WINDOW 0 0 56 VBottom 2
WINDOW 3 32 56 VTop 2
SYMATTR InstName R56
SYMATTR Value 510k
SYMBOL cap -15392 -73680 R0
SYMATTR InstName C27
SYMATTR Value 1n
SYMBOL cap -15456 -73920 R90
WINDOW 0 0 32 VBottom 2
WINDOW 3 32 32 VTop 2
SYMATTR InstName C28
SYMATTR Value 2n
SYMBOL res -16016 -74048 R90
WINDOW 0 0 56 VBottom 2
WINDOW 3 32 56 VTop 2
SYMATTR InstName R57
SYMATTR Value 270k
SYMBOL res -16048 -73664 R0
SYMATTR InstName R58
SYMATTR Value 18k
SYMBOL res -15584 -73632 R90
WINDOW 0 0 56 VBottom 2
WINDOW 3 32 56 VTop 2
SYMATTR InstName R59
SYMATTR Value 43k
SYMBOL res -15440 -73632 R90
WINDOW 0 0 56 VBottom 2
WINDOW 3 32 56 VTop 2
SYMATTR InstName R60
SYMATTR Value 43k
SYMBOL cap -16256 -72912 R90
WINDOW 0 0 32 VBottom 2
WINDOW 3 32 32 VTop 2
SYMATTR InstName C29
SYMATTR Value 1n
SYMBOL cap -16096 -72912 R90
WINDOW 0 0 32 VBottom 2
WINDOW 3 32 32 VTop 2
SYMATTR InstName C30
SYMATTR Value 1n
SYMBOL res -16000 -72864 R0
SYMATTR InstName R61
SYMATTR Value 390k
SYMBOL res -16080 -73120 R90
WINDOW 0 0 56 VBottom 2
WINDOW 3 32 56 VTop 2
SYMATTR InstName R62
SYMATTR Value 43k
SYMBOL res -15632 -72928 R90
WINDOW 0 0 56 VBottom 2
WINDOW 3 32 56 VTop 2
SYMATTR InstName R63
SYMATTR Value 20k
SYMBOL res -15488 -72928 R90
WINDOW 0 0 56 VBottom 2
WINDOW 3 32 56 VTop 2
SYMATTR InstName R64
SYMATTR Value 20k
SYMBOL cap -15440 -72880 R0
SYMATTR InstName C31
SYMATTR Value 1n
SYMBOL cap -15504 -73120 R90
WINDOW 0 0 32 VBottom 2
WINDOW 3 32 32 VTop 2
SYMATTR InstName C32
SYMATTR Value 2n
SYMBOL res -16064 -73248 R90
WINDOW 0 0 56 VBottom 2
WINDOW 3 32 56 VTop 2
SYMATTR InstName R65
SYMATTR Value 510k
SYMBOL res -16096 -72864 R0
SYMATTR InstName R66
SYMATTR Value 100k
SYMBOL cap -16256 -72160 R90
WINDOW 0 0 32 VBottom 2
WINDOW 3 32 32 VTop 2
SYMATTR InstName C33
SYMATTR Value 1n
SYMBOL cap -16096 -72160 R90
WINDOW 0 0 32 VBottom 2
WINDOW 3 32 32 VTop 2
SYMATTR InstName C34
SYMATTR Value 1n
SYMBOL res -16000 -72112 R0
SYMATTR InstName R67
SYMATTR Value 43k
SYMBOL res -16080 -72368 R90
WINDOW 0 0 56 VBottom 2
WINDOW 3 32 56 VTop 2
SYMATTR InstName R68
SYMATTR Value 20k
SYMBOL res -15632 -72176 R90
WINDOW 0 0 56 VBottom 2
WINDOW 3 32 56 VTop 2
SYMATTR InstName R69
SYMATTR Value 10k
SYMBOL res -15488 -72176 R90
WINDOW 0 0 56 VBottom 2
WINDOW 3 32 56 VTop 2
SYMATTR InstName R70
SYMATTR Value 10k
SYMBOL cap -15440 -72128 R0
SYMATTR InstName C35
SYMATTR Value 1n
SYMBOL cap -15504 -72368 R90
WINDOW 0 0 32 VBottom 2
WINDOW 3 32 32 VTop 2
SYMATTR InstName C36
SYMATTR Value 2n
SYMBOL res -16096 -72112 R0
SYMATTR InstName R71
SYMATTR Value 530k
SYMBOL cap -16240 -71392 R90
WINDOW 0 0 32 VBottom 2
WINDOW 3 32 32 VTop 2
SYMATTR InstName C37
SYMATTR Value 1n
SYMBOL cap -16080 -71392 R90
WINDOW 0 0 32 VBottom 2
WINDOW 3 32 32 VTop 2
SYMATTR InstName C38
SYMATTR Value 1n
SYMBOL res -15984 -71344 R0
SYMATTR InstName R72
SYMATTR Value 20k
SYMBOL res -16064 -71600 R90
WINDOW 0 0 56 VBottom 2
WINDOW 3 32 56 VTop 2
SYMATTR InstName R73
SYMATTR Value 10k
SYMBOL res -15616 -71408 R90
WINDOW 0 0 56 VBottom 2
WINDOW 3 32 56 VTop 2
SYMATTR InstName R74
SYMATTR Value 5k
SYMBOL res -15472 -71408 R90
WINDOW 0 0 56 VBottom 2
WINDOW 3 32 56 VTop 2
SYMATTR InstName R75
SYMATTR Value 5k
SYMBOL cap -15424 -71360 R0
SYMATTR InstName C39
SYMATTR Value 1n
SYMBOL cap -15488 -71600 R90
WINDOW 0 0 32 VBottom 2
WINDOW 3 32 32 VTop 2
SYMATTR InstName C40
SYMATTR Value 2n
SYMBOL res -19008 -74000 R90
WINDOW 0 0 56 VBottom 2
WINDOW 3 32 56 VTop 2
SYMATTR InstName R76
SYMATTR Value 100k
SYMBOL res -19264 -73760 R90
WINDOW 0 0 56 VBottom 2
WINDOW 3 32 56 VTop 2
SYMATTR InstName R77
SYMATTR Value 10k
SYMBOL res -19008 -73232 R90
WINDOW 0 0 56 VBottom 2
WINDOW 3 32 56 VTop 2
SYMATTR InstName R78
SYMATTR Value 100k
SYMBOL res -19264 -72992 R90
WINDOW 0 0 56 VBottom 2
WINDOW 3 32 56 VTop 2
SYMATTR InstName R79
SYMATTR Value 10k
SYMBOL res -19008 -72448 R90
WINDOW 0 0 56 VBottom 2
WINDOW 3 32 56 VTop 2
SYMATTR InstName R80
SYMATTR Value 50k
SYMBOL res -19264 -72208 R90
WINDOW 0 0 56 VBottom 2
WINDOW 3 32 56 VTop 2
SYMATTR InstName R81
SYMATTR Value 10k
SYMBOL res -16912 -74000 R90
WINDOW 0 0 56 VBottom 2
WINDOW 3 32 56 VTop 2
SYMATTR InstName R82
SYMATTR Value 1k
SYMBOL res -17168 -73760 R90
WINDOW 0 0 56 VBottom 2
WINDOW 3 32 56 VTop 2
SYMATTR InstName R83
SYMATTR Value 10k
SYMBOL res -16896 -73216 R90
WINDOW 0 0 56 VBottom 2
WINDOW 3 32 56 VTop 2
SYMATTR InstName R84
SYMATTR Value 1k
SYMBOL res -17152 -72976 R90
WINDOW 0 0 56 VBottom 2
WINDOW 3 32 56 VTop 2
SYMATTR InstName R85
SYMATTR Value 10k
SYMBOL res -16896 -72384 R90
WINDOW 0 0 56 VBottom 2
WINDOW 3 32 56 VTop 2
SYMATTR InstName R86
SYMATTR Value 1k
SYMBOL res -17152 -72144 R90
WINDOW 0 0 56 VBottom 2
WINDOW 3 32 56 VTop 2
SYMATTR InstName R87
SYMATTR Value 10k
SYMBOL res -14912 -73744 R90
WINDOW 0 0 56 VBottom 2
WINDOW 3 32 56 VTop 2
SYMATTR InstName R89
SYMATTR Value 10k
SYMBOL res -14656 -73184 R90
WINDOW 0 0 56 VBottom 2
WINDOW 3 32 56 VTop 2
SYMATTR InstName R90
SYMATTR Value 1k
SYMBOL res -14912 -72944 R90
WINDOW 0 0 56 VBottom 2
WINDOW 3 32 56 VTop 2
SYMATTR InstName R91
SYMATTR Value 10k
SYMBOL res -14672 -72432 R90
WINDOW 0 0 56 VBottom 2
WINDOW 3 32 56 VTop 2
SYMATTR InstName R92
SYMATTR Value 1k
SYMBOL res -14928 -72192 R90
WINDOW 0 0 56 VBottom 2
WINDOW 3 32 56 VTop 2
SYMATTR InstName R93
SYMATTR Value 10k
SYMBOL res -14656 -71664 R90
WINDOW 0 0 56 VBottom 2
WINDOW 3 32 56 VTop 2
SYMATTR InstName R94
SYMATTR Value 1k
SYMBOL res -14912 -71424 R90
WINDOW 0 0 56 VBottom 2
WINDOW 3 32 56 VTop 2
SYMATTR InstName R95
SYMATTR Value 10k
SYMBOL bv -20192 -73712 R0
WINDOW 3 -58 164 Left 2
SYMATTR Value V= 1Meg*(V(+1)-V(-1))
SYMATTR InstName B2
SYMBOL bv -19632 -73728 R0
WINDOW 3 -58 164 Left 2
SYMATTR Value V= 1Meg*(V(+2)-V(-2))
SYMATTR InstName B3
SYMBOL bv -19040 -73712 R0
WINDOW 3 -58 164 Left 2
SYMATTR Value V= 1Meg*(V(+3)-V(-3))
SYMATTR InstName B4
SYMBOL bv -20176 -72944 R0
WINDOW 3 -58 164 Left 2
SYMATTR Value V= 1Meg*(V(+4)-V(-4))
SYMATTR InstName B5
SYMBOL bv -19632 -72960 R0
WINDOW 3 -58 164 Left 2
SYMATTR Value V= 1Meg*(V(+5)-V(-5))
SYMATTR InstName B6
SYMBOL bv -19040 -72944 R0
WINDOW 3 -133 157 Left 2
SYMATTR Value V= 1Meg*(V(+6)-V(-6))
SYMATTR InstName B7
SYMBOL bv -20176 -72160 R0
WINDOW 3 -58 164 Left 2
SYMATTR Value V= 1Meg*(V(+7)-V(-7))
SYMATTR InstName B8
SYMBOL bv -19632 -72176 R0
WINDOW 3 -58 164 Left 2
SYMATTR Value V= 1Meg*(V(+8)-V(-8))
SYMATTR InstName B9
SYMBOL bv -19040 -72160 R0
WINDOW 3 -58 164 Left 2
SYMATTR Value V= 1Meg*(V(+9)-V(-9))
SYMATTR InstName B10
SYMBOL bv -18080 -73712 R0
WINDOW 3 -58 164 Left 2
SYMATTR Value V= 1Meg*(V(+10)-V(-10))
SYMATTR InstName B11
SYMBOL bv -17536 -73728 R0
WINDOW 3 -58 164 Left 2
SYMATTR Value V= 1Meg*(V(+11)-V(-11))
SYMATTR InstName B12
SYMBOL bv -16944 -73712 R0
WINDOW 3 -58 164 Left 2
SYMATTR Value V= 1Meg*(V(+12)-V(-12))
SYMATTR InstName B13
SYMBOL bv -18080 -72928 R0
WINDOW 3 -58 164 Left 2
SYMATTR Value V= 1Meg*(V(+13)-V(-13))
SYMATTR InstName B14
SYMBOL bv -17536 -72944 R0
WINDOW 3 -58 164 Left 2
SYMATTR Value V= 1Meg*(V(+14)-V(-14))
SYMATTR InstName B15
SYMBOL bv -16928 -72928 R0
WINDOW 3 -58 164 Left 2
SYMATTR Value V= 1Meg*(V(+15)-V(-15))
SYMATTR InstName B16
SYMBOL bv -18080 -72096 R0
WINDOW 3 -58 164 Left 2
SYMATTR Value V= 1Meg*(V(+16)-V(-16))
SYMATTR InstName B17
SYMBOL bv -17536 -72112 R0
WINDOW 3 -58 164 Left 2
SYMATTR Value V= 1Meg*(V(+17)-V(-17))
SYMATTR InstName B18
SYMBOL bv -16928 -72096 R0
WINDOW 3 -58 164 Left 2
SYMATTR Value V= 1Meg*(V(+18)-V(-18))
SYMATTR InstName B19
SYMBOL bv -15808 -73696 R0
WINDOW 3 -58 164 Left 2
SYMATTR Value V= 1Meg*(V(+19)-V(-19))
SYMATTR InstName B20
SYMBOL bv -15264 -73712 R0
WINDOW 3 -58 164 Left 2
SYMATTR Value V= 1Meg*(V(+20)-V(-20))
SYMATTR InstName B21
SYMBOL bv -14688 -73696 R0
WINDOW 3 -151 162 Left 2
SYMATTR Value V= 1Meg*(V(+21)-V(-21))
SYMATTR InstName B22
SYMBOL bv -15856 -72896 R0
WINDOW 3 -58 164 Left 2
SYMATTR Value V= 1Meg*(V(+22)-V(-22))
SYMATTR InstName B23
SYMBOL bv -15312 -72912 R0
WINDOW 3 -58 164 Left 2
SYMATTR Value V= 1Meg*(V(+23)-V(-23))
SYMATTR InstName B24
SYMBOL bv -14688 -72896 R0
WINDOW 3 -58 164 Left 2
SYMATTR Value V= 1Meg*(V(+24)-V(-24))
SYMATTR InstName B25
SYMBOL bv -15856 -72144 R0
WINDOW 3 -58 164 Left 2
SYMATTR Value V= 1Meg*(V(+25)-V(-25))
SYMATTR InstName B26
SYMBOL bv -15312 -72160 R0
WINDOW 3 -58 164 Left 2
SYMATTR Value V= 1Meg*(V(+26)-V(-26))
SYMATTR InstName B27
SYMBOL bv -14704 -72144 R0
WINDOW 3 -58 164 Left 2
SYMATTR Value V= 1Meg*(V(+27)-V(-27))
SYMATTR InstName B28
SYMBOL bv -15840 -71376 R0
WINDOW 3 -58 164 Left 2
SYMATTR Value V= 1Meg*(V(+28)-V(-28))
SYMATTR InstName B29
SYMBOL bv -15296 -71392 R0
WINDOW 3 -58 164 Left 2
SYMATTR Value V= 1Meg*(V(+29)-V(-29))
SYMATTR InstName B30
SYMBOL bv -14688 -71376 R0
WINDOW 3 -58 164 Left 2
SYMATTR Value V= 1Meg*(V(+30)-V(-30))
SYMATTR InstName B31
SYMBOL res -18256 -71520 R90
WINDOW 0 0 56 VBottom 2
WINDOW 3 32 56 VTop 2
SYMATTR InstName R96
SYMATTR Value 100k
SYMBOL res -18256 -71424 R90
WINDOW 0 0 56 VBottom 2
WINDOW 3 32 56 VTop 2
SYMATTR InstName R97
SYMATTR Value 100k
SYMBOL res -18256 -71328 R90
WINDOW 0 0 56 VBottom 2
WINDOW 3 32 56 VTop 2
SYMATTR InstName R98
SYMATTR Value 100k
SYMBOL res -18256 -71232 R90
WINDOW 0 0 56 VBottom 2
WINDOW 3 32 56 VTop 2
SYMATTR InstName R99
SYMATTR Value 100k
SYMBOL res -18256 -71136 R90
WINDOW 0 0 56 VBottom 2
WINDOW 3 32 56 VTop 2
SYMATTR InstName R100
SYMATTR Value 100k
SYMBOL res -18256 -71040 R90
WINDOW 0 0 56 VBottom 2
WINDOW 3 32 56 VTop 2
SYMATTR InstName R101
SYMATTR Value 100k
SYMBOL res -18256 -70944 R90
WINDOW 0 0 56 VBottom 2
WINDOW 3 32 56 VTop 2
SYMATTR InstName R102
SYMATTR Value 100k
SYMBOL res -18256 -70848 R90
WINDOW 0 0 56 VBottom 2
WINDOW 3 32 56 VTop 2
SYMATTR InstName R103
SYMATTR Value 100k
SYMBOL res -18256 -70752 R90
WINDOW 0 0 56 VBottom 2
WINDOW 3 32 56 VTop 2
SYMATTR InstName R104
SYMATTR Value 100k
SYMBOL res -18256 -70656 R90
WINDOW 0 0 56 VBottom 2
WINDOW 3 32 56 VTop 2
SYMATTR InstName R105
SYMATTR Value 100k
SYMBOL bv -17808 -71264 R0
WINDOW 3 -58 164 Left 2
SYMATTR Value V= 1Meg*(V(+31)-V(-31))
SYMATTR InstName B32
SYMBOL res -17712 -71520 R90
WINDOW 0 0 56 VBottom 2
WINDOW 3 32 56 VTop 2
SYMATTR InstName R106
SYMATTR Value 100k
SYMBOL res -14656 -73984 R90
WINDOW 0 0 56 VBottom 2
WINDOW 3 32 56 VTop 2
SYMATTR InstName R88
SYMATTR Value 1k
SYMBOL voltage -21344 -72928 R0
WINDOW 123 24 44 Left 2
WINDOW 39 0 0 Left 0
SYMATTR InstName V1
SYMATTR Value ""
SYMATTR Value2 AC 1
TEXT -21408 -73464 Left 2 !.ac dec 100 1 100k
RECTANGLE Normal -18880 -73328 -20816 -74112 2
RECTANGLE Normal -18880 -73328 -20816 -74112 2
RECTANGLE Normal -14528 -70960 -16464 -71744 2
RECTANGLE Normal -14528 -70960 -16464 -71744 2
RECTANGLE Normal -18880 -72544 -20816 -73328 2
RECTANGLE Normal -18880 -72544 -20816 -73328 2
RECTANGLE Normal -18880 -71760 -20816 -72544 2
RECTANGLE Normal -18880 -71760 -20816 -72544 2
RECTANGLE Normal -14528 -73312 -16464 -74096 2
RECTANGLE Normal -14528 -73312 -16464 -74096 2
RECTANGLE Normal -14528 -72528 -16464 -73312 2
RECTANGLE Normal -14528 -72528 -16464 -73312 2
RECTANGLE Normal -14528 -71744 -16464 -72528 2
RECTANGLE Normal -14528 -71744 -16464 -72528 2
RECTANGLE Normal -16784 -72544 -18720 -73328 2
RECTANGLE Normal -16784 -72544 -18720 -73328 2
RECTANGLE Normal -16784 -71760 -18720 -72544 2
RECTANGLE Normal -16784 -71760 -18720 -72544 2
RECTANGLE Normal -16784 -73328 -18720 -74112 2
RECTANGLE Normal -16784 -73328 -18720 -74112 2

The netlist it stands for:
* Ecualizador.asc
C1 N001 Vsuma 100n
C2 +1 N001 100n
R5 +1 0 680k
R6 -1 N001 56k
R7 N005 -1 27k
R8 +2 N005 27k
C3 +2 0 100n
C4 -2 N005 200n
R9 -1 N001 560k
R10 +1 0 120k
R11 +2 N005 430k
R12 N005 -1 430k
C5 N008 Vsuma 100n
C6 +4 N008 100n
R13 +4 0 560k
R14 -4 N008 430k
R15 N012 -4 15k
R16 +5 N012 15k
C7 +5 0 100n
C8 -5 N012 200n
R17 -4 N008 27k
R18 +4 0 56k
R19 N012 -4 82k
R20 +5 N012 82k
C9 N015 Vsuma 100n
C10 +7 N015 100n
R21 +7 0 430k
R22 -7 N015 18k
R23 N017 -7 430k
R24 +8 N017 430k
C11 +8 0 10n
C12 -8 N017 20n
R25 -7 N015 43k
R26 +7 0 27k
R27 N017 -7 75k
R28 +8 N017 75k
C13 N002 Vsuma 10n
C14 +10 N002 10n
R29 +10 0 430k
R30 -10 N002 430k
R31 N006 -10 910k
R32 +11 N006 910k
C15 +11 0 10n
C16 -11 N006 20n
R33 -10 N002 75k
R34 +10 0 180k
R35 N006 -10 33k
R36 +11 N006 33k
C17 N009 Vsuma 10n
C18 +13 N009 10n
R37 +13 0 430k
R38 -13 N009 36k
R39 N013 -13 39k
R40 +14 N013 39k
C19 +14 0 10n
C20 -14 N013 20n
R41 -13 N009 270k
R42 +13 0 75k
R43 N013 -13 27k
R44 +14 N013 27k
C21 N016 Vsuma 10n
C22 +16 N016 10n
R45 +16 0 270k
R46 -16 N016 18k
R47 N020 -16 270k
R48 +17 N020 270k
C23 +17 0 10n
C24 -17 N020 20n
R49 -16 N016 150k
R50 +16 0 36k
R51 N020 -16 8.2k
R52 +17 N020 8.2k
C25 N003 Vsuma 10n
C26 +19 N003 10n
R53 +19 0 150k
R54 -19 N003 8.2k
R55 N007 -19 510k
R56 +20 N007 510k
C27 +20 0 1n
C28 -20 N007 2n
R57 -19 N003 270k
R58 +19 0 18k
R59 N007 -19 43k
R60 +20 N007 43k
C29 N010 Vsuma 1n
C30 +22 N010 1n
R61 +22 0 390k
R62 -22 N010 43k
R63 N014 -22 20k
R64 +23 N014 20k
C31 +23 0 1n
C32 -23 N014 2n
R65 -22 N010 510k
R66 +22 0 100k
C33 N018 Vsuma 1n
C34 +25 N018 1n
R67 +25 0 43k
R68 -25 N018 20k
R69 N019 -25 10k
R70 +26 N019 10k
C35 +26 0 1n
C36 -26 N019 2n
R71 +25 0 530k
C37 N021 Vsuma 1n
C38 +28 N021 1n
R72 +28 0 20k
R73 -28 N021 10k
R74 N022 -28 5k
R75 +29 N022 5k
C39 +29 0 1n
C40 -29 N022 2n
R76 Vbanda1 -3 100k
R77 -3 -2 10k
R78 Vbanda2 -6 100k
R79 -6 -5 10k
R80 Vbanda3 -9 50k
R81 -9 -8 10k
R82 N004 -12 1k
R83 -12 -11 10k
R84 N011 -15 1k
R85 -15 -14 10k
R86 Vbanda6 -18 1k
R87 -18 -17 10k
R89 -21 -20 10k
R90 Vbanda8 -24 1k
R91 -24 -23 10k
R92 Vbanda9 -27 1k
R93 -27 -26 10k
R94 Vbanda10 -30 1k
R95 -30 -29 10k
B2 -1 0 V= 1Meg*(V(+1)-V(-1))
B3 -2 0 V= 1Meg*(V(+2)-V(-2))
B4 Vbanda1 0 V= 1Meg*(V(+3)-V(-3))
B5 -4 0 V= 1Meg*(V(+4)-V(-4))
B6 -5 0 V= 1Meg*(V(+5)-V(-5))
B7 Vbanda2 0 V= 1Meg*(V(+6)-V(-6))
B8 -7 0 V= 1Meg*(V(+7)-V(-7))
B9 -8 0 V= 1Meg*(V(+8)-V(-8))
B10 Vbanda3 0 V= 1Meg*(V(+9)-V(-9))
B11 -10 0 V= 1Meg*(V(+10)-V(-10))
B12 -11 0 V= 1Meg*(V(+11)-V(-11))
B13 N004 0 V= 1Meg*(V(+12)-V(-12))
B14 -13 0 V= 1Meg*(V(+13)-V(-13))
B15 -14 0 V= 1Meg*(V(+14)-V(-14))
B16 N011 0 V= 1Meg*(V(+15)-V(-15))
B17 -16 0 V= 1Meg*(V(+16)-V(-16))
B18 -17 0 V= 1Meg*(V(+17)-V(-17))
B19 Vbanda6 0 V= 1Meg*(V(+18)-V(-18))
B20 -19 0 V= 1Meg*(V(+19)-V(-19))
B21 -20 0 V= 1Meg*(V(+20)-V(-20))
B22 Vbanda7 0 V= 1Meg*(V(+21)-V(-21))
B23 -22 0 V= 1Meg*(V(+22)-V(-22))
B24 -23 0 V= 1Meg*(V(+23)-V(-23))
B25 Vbanda8 0 V= 1Meg*(V(+24)-V(-24))
B26 -25 0 V= 1Meg*(V(+25)-V(-25))
B27 -26 0 V= 1Meg*(V(+26)-V(-26))
B28 Vbanda9 0 V= 1Meg*(V(+27)-V(-27))
B29 -28 0 V= 1Meg*(V(+28)-V(-28))
B30 -29 0 V= 1Meg*(V(+29)-V(-29))
B31 Vbanda10 0 V= 1Meg*(V(+30)-V(-30))
R96 -31 Vbanda1 100k
R97 -31 Vbanda2 100k
R98 -31 Vbanda3 100k
R99 -31 -12 100k
R100 -31 -15 100k
R101 -31 Vbanda6 100k
R102 -31 Vbanda7 100k
R103 -31 Vbanda8 100k
R104 -31 Vbanda9 100k
R105 -31 Vbanda10 100k
B32 Vout 0 V= 1Meg*(V(+31)-V(-31))
R106 Vout -31 100k
R88 Vbanda7 -21 1k
V1 Vsuma 0 AC 1
.ac dec 100 1 100k
.backanno
.end

* Results of the author's LTspice run, read from the files saved beside the schematic
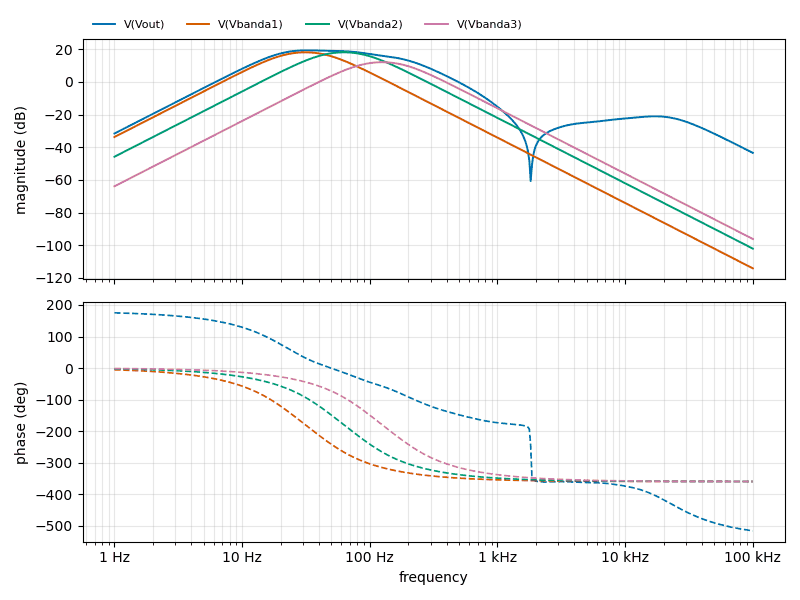
[diagram p3: AC Analysis of Ecualizador.asc, plotted from the saved traces]
* AC Analysis, 1 run:
*   V(Vout): -31.62 dB at 1 Hz, -43.46 dB at 100 kHz, peak 19.28 dB at 32.36 Hz, 3 dB below the peak at 17.87 Hz and 117.7 Hz
*   V(Vbanda1): -33.76 dB at 1 Hz, -114.14 dB at 100 kHz, peak 18.08 dB at 31.62 Hz, 3 dB below the peak at 18.51 Hz and 52.83 Hz
*   V(Vbanda2): -45.84 dB at 1 Hz, -102.07 dB at 100 kHz, peak 18.08 dB at 63.1 Hz, 3 dB below the peak at 37.09 Hz and 105.8 Hz
*   V(Vbanda3): -63.93 dB at 1 Hz, -96.18 dB at 100 kHz, peak 12.02 dB at 125.9 Hz, 3 dB below the peak at 74.12 Hz and 210.7 Hz